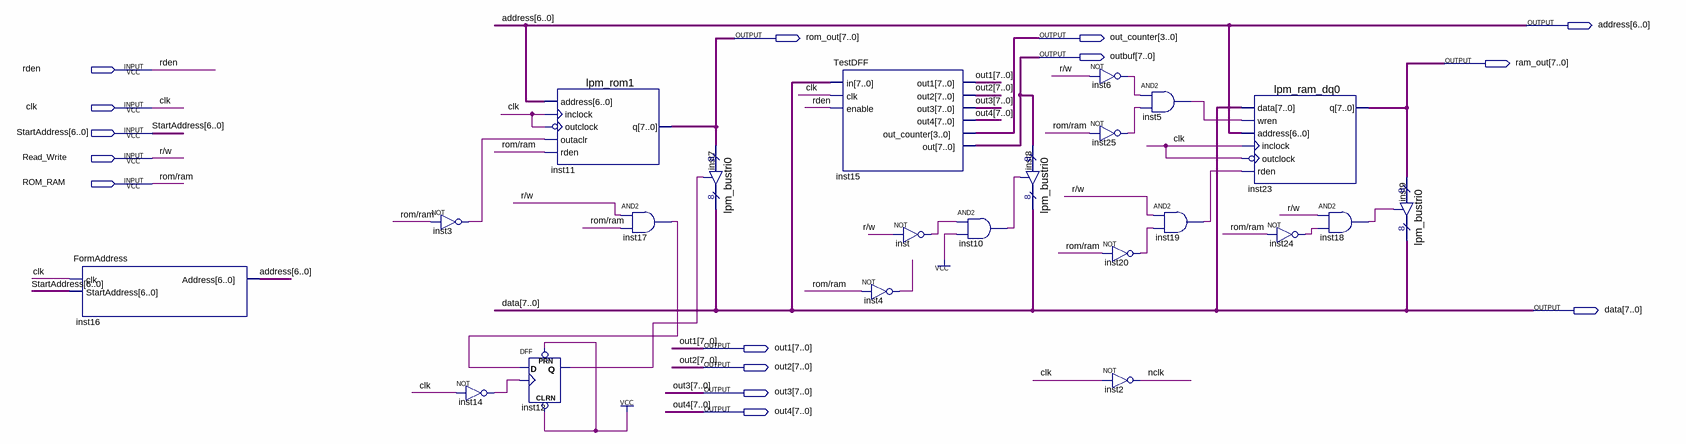
[diagram p0: schematic sheet]
// Quartus schematic lab3.bdf as structural Verilog: 22 symbols, 15 pins
module lab3 (
  input  rden,
  input  clk,
  input  [6:0] StartAddress,
  input  Read_Write,
  input  ROM_RAM,
  output [6:0] address,
  output [7:0] rom_out,
  output [3:0] out_counter,
  output [7:0] outbuf,
  output [7:0] ram_out,
  output [7:0] data,
  output [7:0] out1,
  output [7:0] out2,
  output [7:0] out3,
  output [7:0] out4
);

  wire inst3_out, inst4_out, inst5_out, inst6_out, inst10_out, inst12_q, inst14_out, inst17_out, inst18_out,
       inst19_out, inst20_out, inst24_out, inst25_out, inst_out, nclk;

  FormAddress inst16 (.clk(clk), .StartAddress(StartAddress), .Address(address));
  not inst3 (inst3_out, ROM_RAM);
  not inst14 (inst14_out, clk);
  lpm_rom1 inst11 (.address(address), .inclock(clk), .outclock(~clk), .outaclr(inst3_out), .rden(ROM_RAM), .q(rom_out));
  DFF inst12 (.CLRN(1'b1), .CLK(inst14_out), .D(inst17_out), .PRN(1'b1), .Q(inst12_q));
  and inst17 (inst17_out, Read_Write, ROM_RAM);
  lpm_bustri0 inst7 (.enabledt(inst12_q), .data(rom_out), .tridata(data));
  TestDFF inst15 (
    .in(data), .clk(clk), .enable(rden), .out1(out1), .out2(out2), .out3(out3), .out4(out4),
    .out_counter(out_counter), .out(outbuf));
  not inst (inst_out, Read_Write);
  not inst4 (inst4_out, ROM_RAM);
  and inst10 (inst10_out, inst_out, 1'b1);
  lpm_bustri0 inst8 (.enabledt(inst10_out), .data(outbuf), .tridata(data));
  not inst6 (inst6_out, Read_Write);
  not inst25 (inst25_out, ROM_RAM);
  not inst20 (inst20_out, ROM_RAM);
  not inst2 (nclk, clk);
  and inst5 (inst5_out, inst6_out, inst25_out);
  and inst19 (inst19_out, Read_Write, inst20_out);
  lpm_ram_dq0 inst23 (
    .data(data), .wren(inst5_out), .address(address), .inclock(clk), .outclock(~clk), .rden(inst19_out),
    .q(ram_out));
  not inst24 (inst24_out, ROM_RAM);
  and inst18 (inst18_out, Read_Write, inst24_out);
  lpm_bustri0 inst9 (.enabledt(inst18_out), .data(ram_out), .tridata(data));

  // Other names for the same wires on the sheet: r/w = Read_Write; rom/ram = ROM_RAM
endmodule
